# Altium schematic sheet ST_LINK_V2-1.SCHDOC: ST-LINK/V2-1
size A4; DocumentNumber: MB1167; Revision: B.1; SheetNumber: 15; SheetTotal: 17; Project: STM327x6G-EVAL
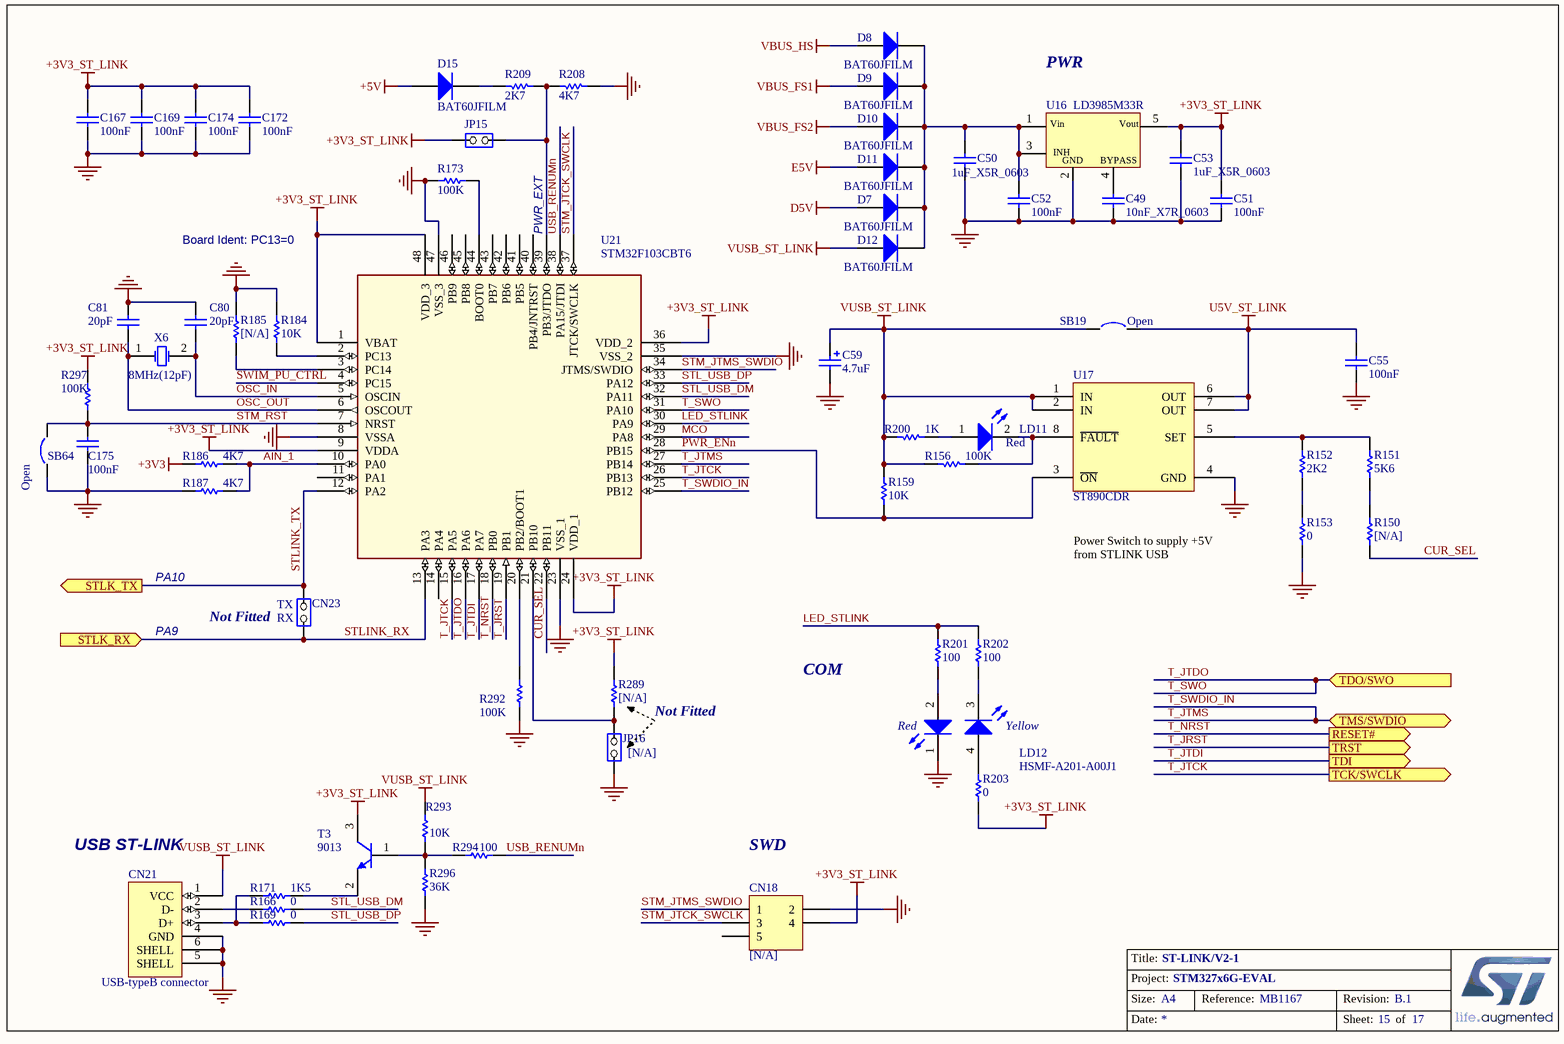
[diagram p0: ST_LINK_V2-1.SCHDOC]

## Parts
C49  10nF_X7R_0603  [0603C]
C50  1uF_X5R_0603  [0603C]
C51  100nF  [0603C]
C52  100nF  [0603C]
C53  1uF_X5R_0603  [0603C]
C55  100nF  [0603C]
C59  4.7uF  [TAN-A]
C80  20pF  [0603C]
C81  20pF  [0603C]
C167  100nF  [0603C]
C169  100nF  [0603C]
C172  100nF  [0603C]
C174  100nF  [0603C]
C175  100nF  [0603C]
CN18  [N/A]  [HDR_2X3-1_2R54-6]
CN21  USB-typeB connector  [USB-B]
CN23  (no value)  [SIP2]
D7  BAT60JFILM  [SOD-323]
D8  BAT60JFILM  [SOD-323]
D9  BAT60JFILM  [SOD-323]
D10  BAT60JFILM  [SOD-323]
D11  BAT60JFILM  [SOD-323]
D12  BAT60JFILM  [SOD-323]
D15  BAT60JFILM  [SOD-323]
JP15  (no value)  [SIP2]
JP16  [N/A]  [SIP2]
LD11  Red  [0603D]
LD12  HSMF-A201-A00J1  [LED2_3528]
R150  [N/A]  [0603R]
R151  5K6  [0402R]
R152  2K2  [0402R]
R153  0  [0603R]
R156  100K  [0603R]
R159  10K  [0402R]
R166  0  [0603R]
R169  0  [0603R]
R171  1K5  [0603R]
R173  100K  [0603R]
R184  10K  [0603R]
R185  [N/A]  [0603R]
R186  4K7  [0603R]
R187  4K7  [0603R]
R200  1K  [0603R]
R201  100  [0603R]
R202  100  [0603R]
R203  0  [0603R]
R208  4K7  [0603R]
R209  2K7  [0603R]
R289  [N/A]  [0603R]
R292  100K  [0603R]
R293  10K  [0603R]
R294  100  [0603R]
R296  36K  [0603R]
R297  100K  [0603R]
SB19  Open  [SB_0603]
SB64  Open  [SB_0603]
T3  9013  [SOT-23]
U16  LD3985M33R  [SOT23-5]
U17  ST890CDR  [SOIC8_1R27_4R9X6]
U21  STM32F103CBT6  [LQFP48_0R5_9X9]
X6  8MHz(12pF)  [XTAL_2SM_12R7X4R7]

## Ports
RESET# (out), STLK_RX (in), STLK_TX (out), TCK/SWCLK (out), TDI (out), TDO/SWO (in), TMS/SWDIO (bidir), TRST (out)

## Nets
+3V3: R186.1
+3V3_ST_LINK: C51.2 C53.1 C167.2 C169.2 C172.2 C174.2 CN18.4 JP15.1(COMMON) R203.2 R289.1 R297.2 T3.3(C) U16.5(Vout) U21.1(VBAT) U21.9(VDDA) U21.24(VDD_1) U21.36(VDD_2) U21.48(VDD_3)
+5V: D15.1(A)
D5V: D7.1(A)
E5V: D11.1(A)
GND: C49.1 C50.1 C51.1 C52.1 C53.2 C55.1 C59.2 C80.2 C81.2 C167.1 C169.1 C172.1 C174.1 C175.1 CN18.2 CN21.4(GND) CN21.5(SHELL) CN21.6(SHELL) JP16.1(COMMON) LD12.1(RED_cathode) R153.1 R173.1 R184.1 R185.1 R187.1 R208.2 R292.1 R296.1 SB64.1 U16.2(GND) U17.4(GND) U21.8(VSSA) U21.23(VSS_1) U21.35(VSS_2) U21.47(VSS_3)
U5V_ST_LINK: C55.2 SB19.2 U17.6(OUT) U17.7(OUT)
VBUS_FS1: D9.1(A)
VBUS_FS2: D10.1(A)
VBUS_HS: D8.1(A)
VUSB_ST_LINK: C59.1 CN21.1(VCC) D12.1(A) R156.1 R159.1 R200.1 R293.2 SB19.1 U17.1(IN) U17.2(IN)
AIN_1: R186.2 R187.2 U21.10(PA0)
CUR_SEL: R150.1 U21.22(PB11)
LED_STLINK: R201.1 R202.1 U21.30(PA9)
MCO: U21.29(PA8)
OSC_IN: C80.1 U21.5(OSCIN) X6.2(OSC2)
OSC_OUT: C81.1 U21.6(OSCOUT) X6.1(OSC1)
PWR_ENn: R159.2 U17.3(~{ON}) U21.28(PB15)
STL_USB_DM: R166.2 U21.32(PA11)
STL_USB_DP: R169.2 U21.33(PA12)
STLINK_RX: CN23.1(COMMON) U21.13(PA3) ; port STLK_RX
STLINK_TX: CN23.2(NO) U21.12(PA2) ; port STLK_TX
STM_JTCK_SWCLK: CN18.3 U21.37(JTCK/SWCLK)
STM_JTMS_SWDIO: CN18.1 U21.34(JTMS/SWDIO)
STM_RST: C175.2 R297.1 SB64.2 U21.7(NRST)
SWIM_PU_CTRL: U21.4(PC15)
T_JRST: U21.19(PB1) ; port TRST
T_JTCK: U21.15(PA5) U21.26(PB13) ; port TCK/SWCLK
T_JTDI: U21.17(PA7) ; port TDI
T_JTDO: U21.16(PA6) U21.31(PA10) ; port TDO/SWO  [also labelled T_SWO]
T_JTMS: U21.25(PB12) U21.27(PB14) ; port TMS/SWDIO  [also labelled T_SWDIO_IN]
T_NRST: U21.18(PB0) ; port RESET#
USB_RENUMn: R294.2 U21.38(PA15/JTDI)
NetC49_2: C49.2 U16.4(BYPASS)
NetC50_2: C50.2 C52.2 D7.2(K) D8.2(K) D9.2(K) D10.2(K) D11.2(K) D12.2(K) U16.1(Vin) U16.3(CE)
NetCN21_2: CN21.2(D-) R166.1
NetCN21_3: CN21.3(D+) R169.1 R171.1
NetD15_2: D15.2(K) R209.1
NetJP15_2: JP15.2(NO) R208.1 R209.2 U21.39(PB3/JTDO)
NetJP16_2: JP16.2(NO) R289.2 U21.21(PB10)
NetLD11_1: LD11.1(A) R200.2
NetLD11_2: LD11.2(K) R156.2 U17.8(~{FAULT})
NetLD12_2: LD12.2(Red_anode) R201.2
NetLD12_3: LD12.3(YellowGreen_cathode) R202.2
NetLD12_4: LD12.4(YellowGreen_anode) R203.1
NetR150_2: R150.2 R151.1
NetR151_2: R151.2 R152.2 U17.5(SET)
NetR152_1: R152.1 R153.2
NetR171_2: R171.2 T3.2(E)
NetR173_2: R173.2 U21.44(BOOT0)
NetR184_2: R184.2 U21.2(PC13)
NetR185_2: R185.2 U21.3(PC14)
NetR292_2: R292.2 U21.20(PB2/BOOT1)
NetR293_1: R293.1 R294.1 R296.2 T3.1(B)

Not connected (* = marked no-connect by the designer): CN18 5; U21 11(PA1) 14(PA4) 40(PB4/JNTRST) 41(PB5) 42(PB6) 43(PB7) 45(PB8) 46(PB9)

## Notes on the sheet
- PWR
- Board Ident: PC13=0
- (near U21) PWR_EXT
- PA10
- Power Switch to supply +5V from STLINK USB
- PA9
- (near CN23) Not Fitted
- (near CN23) TX
- (near CN23) RX
- Not Fitted
- COM
- (near CN21) USB ST-LINK
- SWD
- Title:
- Project:
- Size:
- Date:
- A4
- Reference:
- Sheet:
- Revision:
- of
- (in symbol HSMF-A201-A00J1) Red; Yellow
- (in symbol LD3985M33R) INH

## Library data of the parts
C49 = CAP SMD 0603  X7R 10000PF 50V 10%: 0603  X7R 10NF; Order code RS: 2040779; Rated voltage: 50V; Tolerance: 10%; Order code Farnell: 7569548RL; Value: 10NF; Power: *; Technology: X7R; Temperature Factor: *; Temperature Min: -55°C; Temperature Max: +125°C; STS Code: *
C50 C53 = CAP SMD 0603  X5R 1µF 25V 10%: 0603  X5R 1µF; Rated voltage: 25V; Tolerance: 10%; Manufacturer: *; Manufacturer P/N: *; Order code Farnell: 1288202RL; Value: 1µF; Power: *; Technology: X5R; Temperature  Factor: *; Temperature Max: +125°C; Temperature Min: -55°C; STS Code: *
C51 C52 C55 C167 C169 C172 C174 C175 = Capacitor_ST: Capacitor 0402 / 0603 / 0805; Revision: July-2002: Re-released for DXP Platform.; Value: 100nF
C59 = Cap Pol1: Polarized Capacitor (Radial); Value: 100pF; Ordered by: Subcon; Published: 8-Jun-2000; Revision: July-2002: Re-released for DXP Platform.; Publisher: Altium Limited
C80 C81 = Capacitor_ST: Capacitor 0402 / 0603 / 0805; Value: 100nF; Revision: July-2002: Re-released for DXP Platform.
CN18 = Header 3X2: Header, 3-Pin, Dual row; Revision: 17-Jul-2002: Re-released for DXP Platform.; Publisher: Altium Limited
CN23 = JP2: Fitted: NO
D7-D12 = BAT60JFILM: Manuf_1: STM; Provided: ST; ECCN_US/EU: EAR99/NEC; Revision: July-2002: Re-released for DXP Platform.; Order: BAT60JFILM; Manuf_Part_1: BAT60JFILM; Distrib: ST
D15 = Diode: Default Diode; Code - JEDEC: DO-214-AB; Ordered by: STM; ECCN_US/EU: EAR99/NEC; Published: 8-Jun-2000; Revision: July-2002: Re-released for DXP Platform.; Publisher: Altium Limited
JP15 = JP2: Ordered by: Subcon; Silkscreen: Pwr_ext
JP16 = JP2
LD11 = LED2: Typical RED, GREEN, YELLOW, AMBER GaAs LED; Published: 8-Jun-2000; Revision: July-2002: Re-released for DXP Platform.; Publisher: Altium Limited
R150 R153 R201-R203 R208 R209 R289 R293 R296 = Res1: Resistor; Value: 1K; Published: 8-Jun-2000; Revision: July-2002: Re-released for DXP Platform.; Publisher: Altium Limited
R151 R152 R166 R169 R171 R173 R292 R294 R297 = Resistor_ST: Resistor 0402 / 0603 / 0805; Description: Resistor 0402 or 0603 or 0805; Value: 10K
R156 = Res1: Resistor; Value: 1K; Ordered by: Subcon; Published: 8-Jun-2000; Revision: July-2002: Re-released for DXP Platform.; Publisher: Altium Limited
R159 R184 = Resistor_ST: Resistor 0402 / 0603 / 0805; Description: Resistor 0402 or 0603 or 0805; Value: 10K
R185-R187 = Resistor_ST: Resistor 0402 / 0603 / 0805; Description: Resistor 0402 or 0603 or 0805; Value: 10K; Fitted: NO
R200 = Res1: Resistor; Ordered by: Subcon; Published: 8-Jun-2000; Revision: July-2002: Re-released for DXP Platform.; Publisher: Altium Limited; Value: 1K
SB19 SB64 = Circuit Breaker: Published: 24-Mar-1999; Revision: July-2002: Re-released for DXP Platform.; Publisher: Altium Limited
T3 = NPN: NPN Bipolar Transistor; Code - JEDEC: TO-226-AA; Published: 8-Jun-2000; Revision: July-2002: Re-released for DXP Platform.; Publisher: Altium Limited
U16 = LD3985M33R: Ultra low drop-low noise BiCMOS voltage, regulators low ESR capacitors compatible; Manuf_1: STM; Provided: ST; Ref St: 9176161; ECCN_US/EU: EAR99/NEC; Manuf_Part_1: LD3985M33R; Distrib: ST; Order: LD3985M33R
U21 = STM32F103CBT6: Medium-density performance line ARM-based 32-bit MCU with 64KB Flash; Manuf_Part_1: STM32F103C8T6; Manuf_1: STM; Ref St: 9175981; Provided: ST; ECCN_US/EU: 3A991A2/NEC; Footprint: QFP48 7X7; Distrib: ST; Order: STM32F103C8T6
X6 = XTAL: Crystal Oscillator; Published: 8-Jun-2000; LatestRevisionDate: 17-Jul-2002; LatestRevisionNote: Re-released for DXP Platform.; PackageReference: R38; Publisher: Altium Limited